# EAGLE design plastic-mint-tin-mk-1.0 (EAGLE 6.5.0)
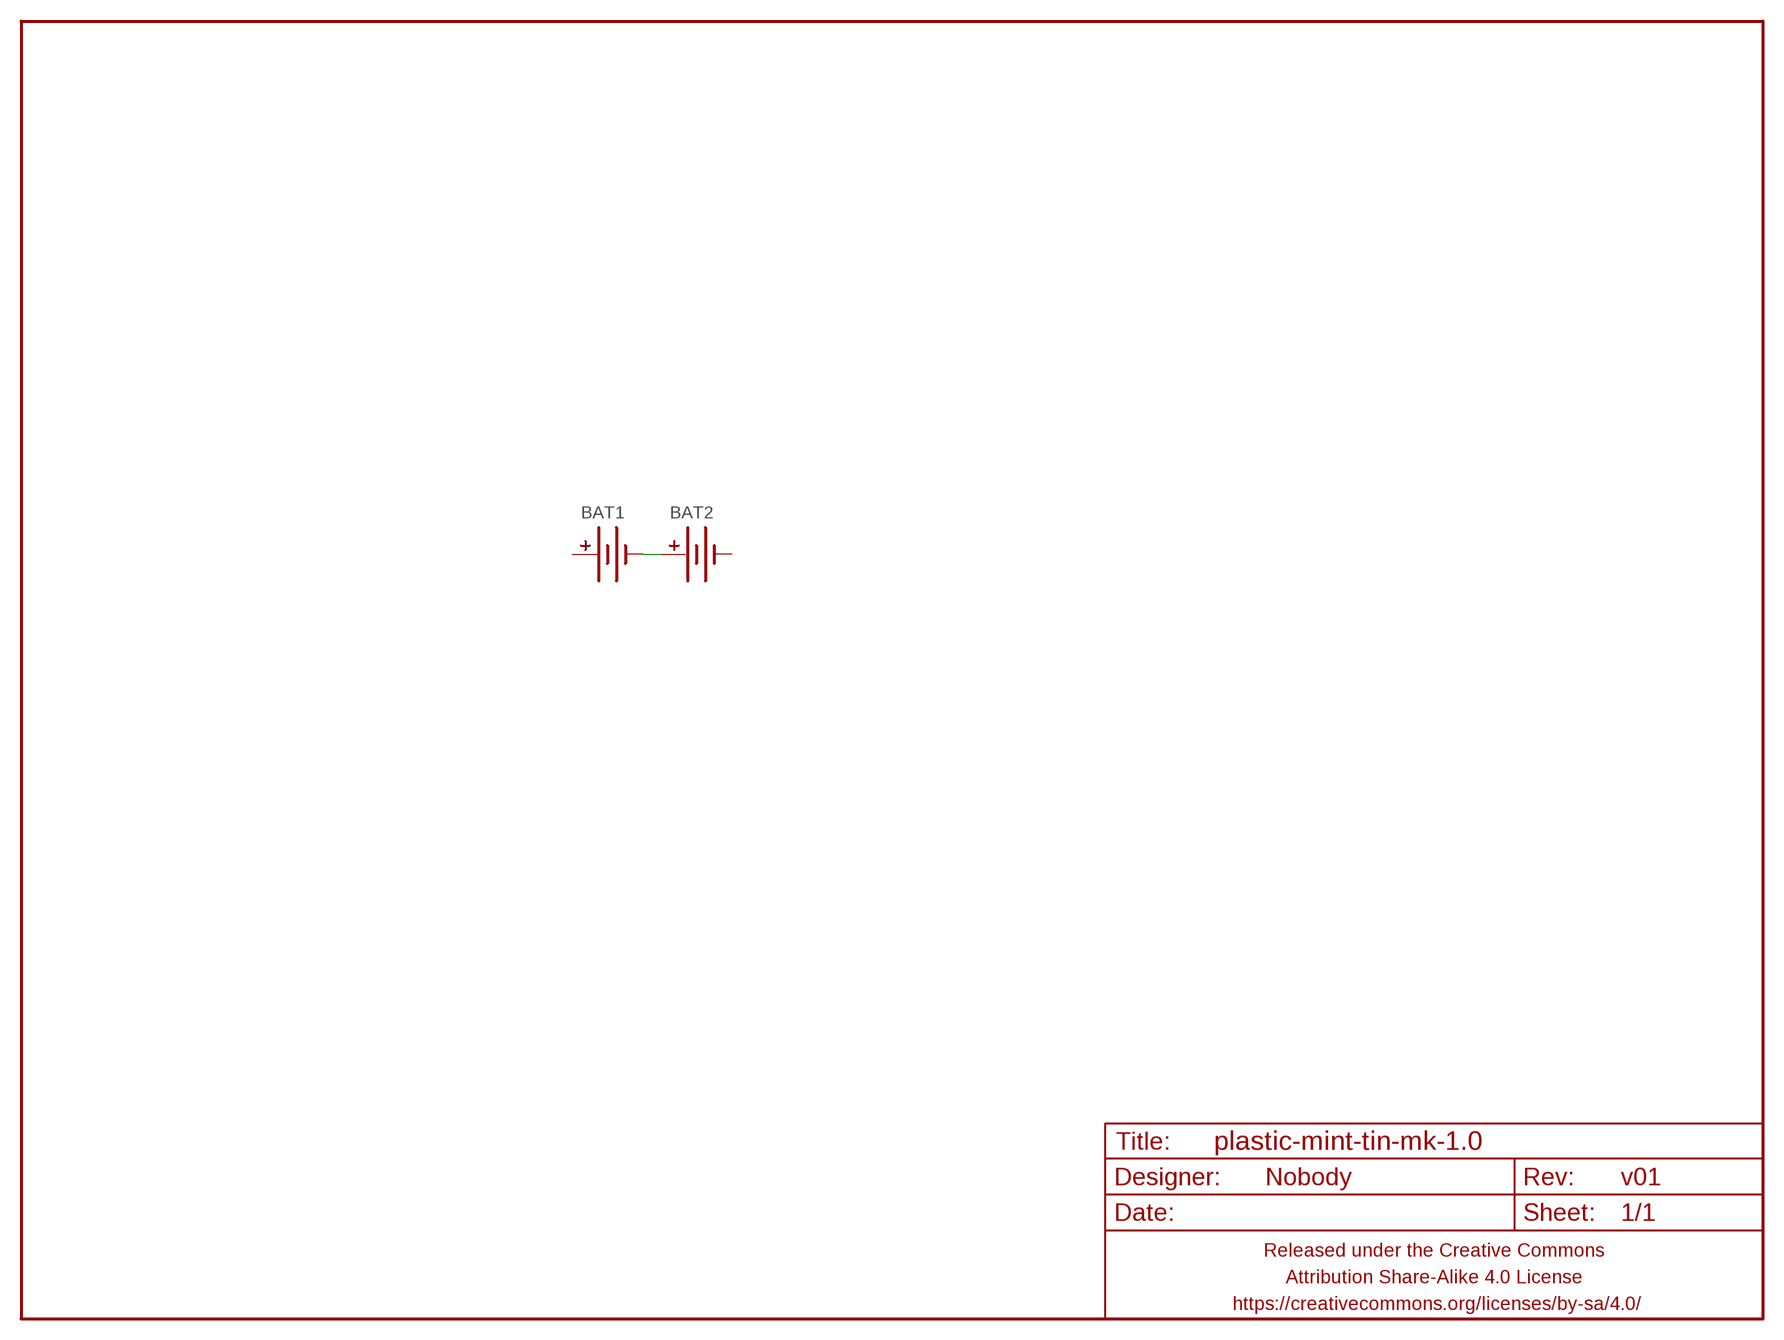
[diagram p0: schematic, sheet 1]

## Parts
BAT1  BATTERYAA  [BATTERY-AA]
BAT2  BATTERYAA  [BATTERY-AA]
FRAME1  FRAME-LETTERNO_PACKAGE  [DUMMY]

## Nets
N$1: BAT1.GND@1(-) BAT1.GND@2(-) BAT2.PWR@1(+) BAT2.PWR@2(+)

## Power pins joined to a net without a drawn wire
+: BAT1.PWR@1(+) BAT1.PWR@2(+)
-: BAT2.GND@1(-) BAT2.GND@2(-)

## Library data of the parts
BAT1 BAT2 = A_butts:BATTERY: Battery Holders Various common sizes : AA, AAA, 20mm coin cell and 12mm coin cell. 20MM_4LEGS, BATT-10373
FRAME1 = A_butts:FRAME-LETTER: Schematic Frame Standard 8.5x11 US Letter frame; DESIGNER: Nobody; VERSION: v01

## Board
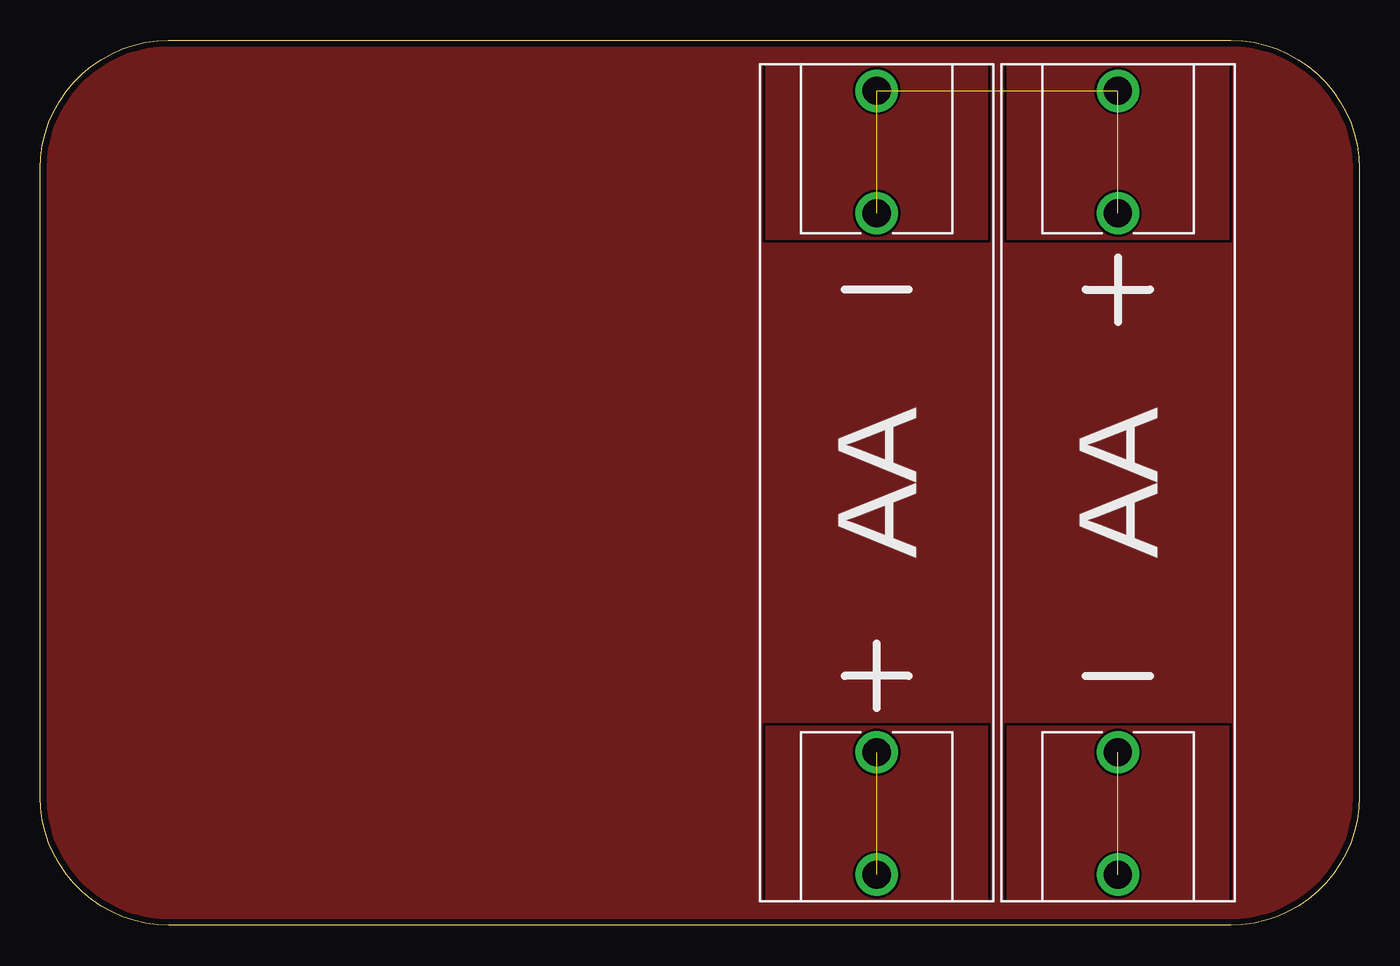
[diagram p1: board, top side]

Size 82 x 55 mm. Coordinates in mm from the lower left corner, seen from the top.
Outline: 8,55 74,55 arc-90 82,47 82,8 arc-90 74,0 8,0 arc-90 0,8 0,47 arc-90 8,55
Copper layers (1*16): Top 0.0356mm / dielectric 1.5011mm / Bottom 0.0356mm
Design rules "LaenPCBOrder2": minimum track width 6mil, minimum drill 13mil, track to track 6mil, track to pad 6mil, pad to pad 6mil, via to via 6mil, smd to smd 6mil, copper to edge 15mil, drill to drill 6mil, minimum pad ring 7mil, minimum via ring 7mil, stop-mask expansion 3mil, vias tented up to drill 20mil, thermal gap 10mil

### Footprints (pad centres in the part's own frame; a part is rotated, then mirrored left to right if it is on the bottom)
BATTERY-AA = drill 1.75: GND@1 24.35,0; GND@2 16.75,0; PWR@1 -24.35,0; PWR@2 -16.75,0

### Placement (x,y rotation side)
BAT1  52,27.5 90 top
BAT2  67,27.5 270 top
FRAME1  0,0 0 top

### Tracks (layer width: path | path; a pad name or v marks a point on that pad's centre or on a via)
+  (1 unrouted)
-  (1 unrouted)
N$1  (3 unrouted)
N$2
  pour Top: -0.1,47.1 -0.1,7.9 arc90 7.9,-0.1 74.1,-0.1 arc90 82.1,7.9 82.1,47.1 arc90 74.1,55.1 7.9,55.1 arc90